# Altium schematic sheet Time4CM4_SIT_module.SchDoc
size A4; SheetNumber: 1; SheetTotal: 1
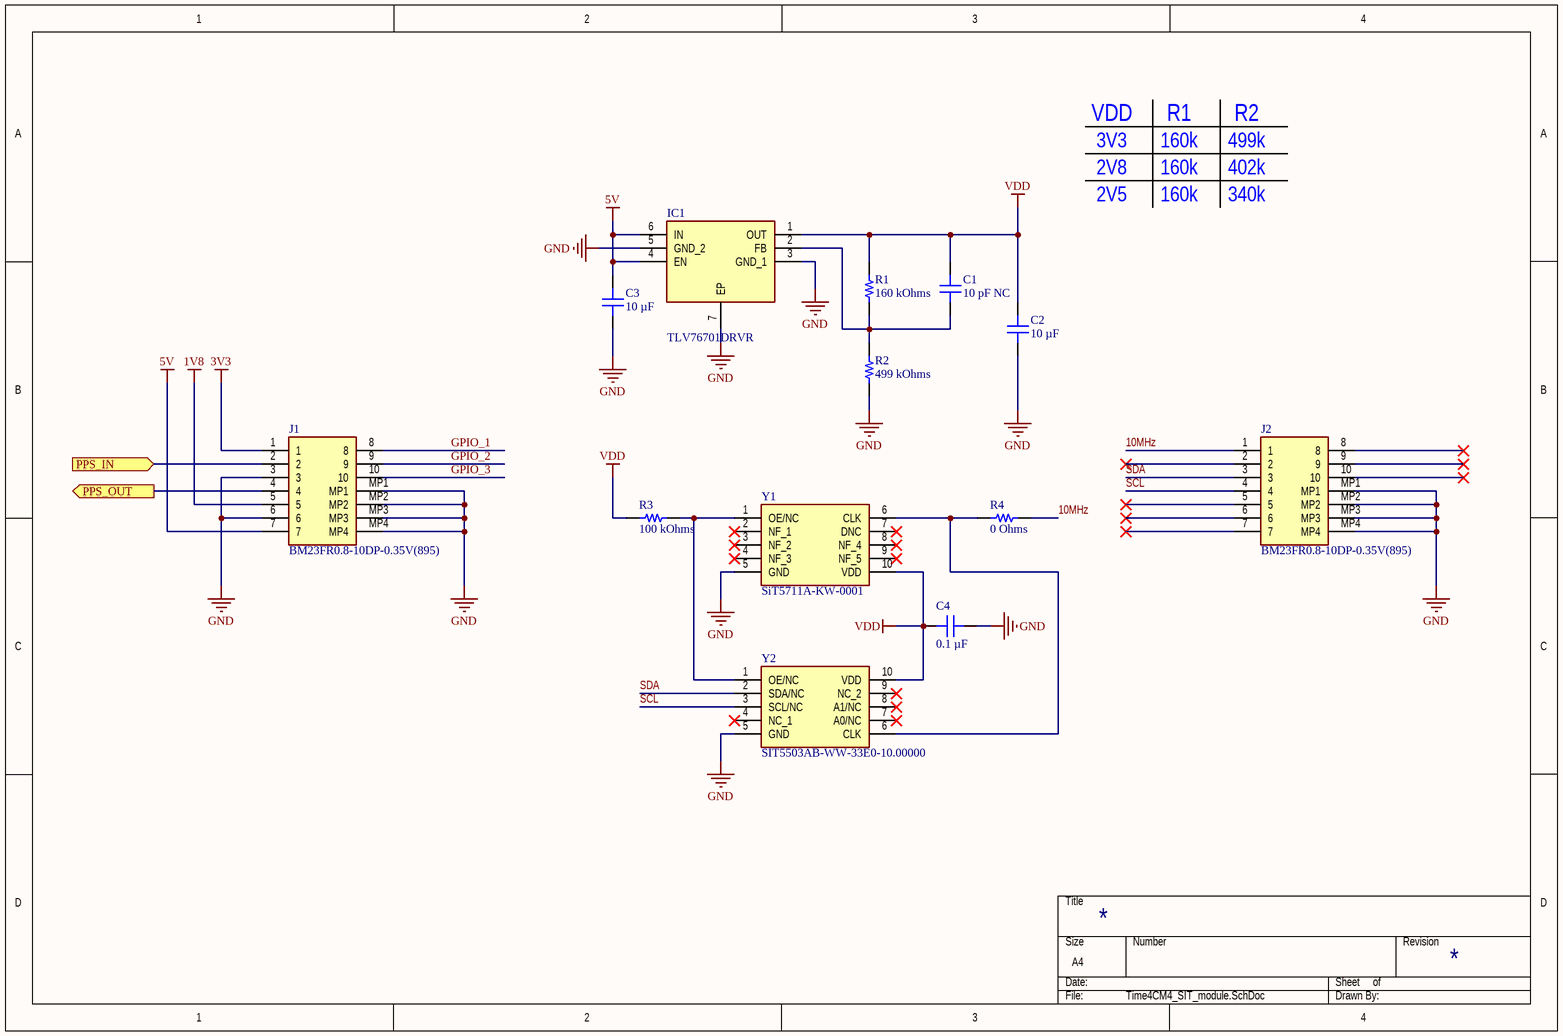
[diagram p0: Time4CM4_SIT_module.SchDoc]

## Parts
C1  10 pF NC  [CAP 0402_1005]
C2  10 µF  [CAP 0603_1608]
C3  10 µF  [CAP 0603_1608]
C4  0.1 µF  [CAP 0402_1005]
IC1  TLV76701DRVR  [SON65P200X200X80-7N]
J1  BM23FR0.8-10DP-0.35V(895)  [BM23FR0810DP035V895]
J2  BM23FR0.8-10DP-0.35V(895)  [BM23FR0810DP035V895]
R1  160 kOhms  [YAGEO RES 0402_1005]
R2  499 kOhms  [YAGEO RES 0402_1005]
R3  100 kOhms  [YAGEO RES 0402_1005]
R4  0 Ohms  [YAGEO RES 0402_1005]
Y1  SiT5711A-KW-0001  [Emerald_9070_10pins_2022]
Y2  SIT5503AB-WW-33E0-10.00000  [Ceramic_QFN_7050_10pins]

## Ports
PPS_IN (in), PPS_OUT (out)

## Nets
1V8: J1.5
3V3: J1.1
5V: C3.2 IC1.4(EN) IC1.6(IN) J1.7
GND: C2.1 C3.1 C4.1 IC1.3(GND_1) IC1.5(GND_2) IC1.7(EP) J1.3 J1.6 J1.MP1 J1.MP2 J1.MP3 J1.MP4 J2.MP1 J2.MP2 J2.MP3 J2.MP4 R2.1 Y1.5(GND) Y2.5(GND)
VDD: C1.2 C2.2 C4.2 IC1.1(OUT) R1.2 R3.1 Y1.10(VDD) Y2.10(VDD)
10MHz: J2.1 R4.1
GPIO_1: J1.8
GPIO_2: J1.9
GPIO_3: J1.10
PPS_IN: J1.2 ; port PPS_IN
PPS_OUT: J1.4 ; port PPS_OUT
SCL: J2.4 Y2.3(SCL/NC)
SDA: J2.3 Y2.2(SDA/NC)
NetC1_1: C1.1 IC1.2(FB) R1.1 R2.2
NetR3_2: R3.2 Y1.1(OE/NC) Y2.1(OE/NC)
NetR4_2: R4.2 Y1.6(CLK) Y2.6(CLK)

Not connected (* = marked no-connect by the designer): J2 2* 5* 6* 7* 8* 9* 10*; Y1 2(NF_1)* 3(NF_2)* 4(NF_3)* 7(DNC)* 8(NF_4)* 9(NF_5)*; Y2 4(NC_1)* 7(A0/NC)* 8(A1/NC)* 9(NC_2)*

## Notes on the sheet
- VDD
- R1
- R2
- 2V8
- 3V3
- 160k
- 499k
- 402k
- 2V5
- 340k
- DWG. NO.
- REV.
- SHT.
- REVISION
- DESCRIPTION
- DATE
- APPROVED
- THIS DOCUMENT AND THE DATA DISCLOSED HEREIN OR HEREWITH IS THE PROPERTY OF ALTIUM LIMITED AND MAY BE FREELY DISTRIBUTED IN WHOLE. NO RIGHTS ARE RESERVED OR EXPRESS OR IMPLIED WARANTEE GIVEN.
- ENG:
- DSN:
- APPROVALS
- PROJECT
- DOCUMENT REVISION:
- DESIGN ITEM:
- CHK:
- BOM:
- REFERENCE DOCUMENTS
- PROJECT REVISION:
- TITLE
- FAB DWG:
- PCB DWG:
- ASSY DWG:
- SCALE:
- SIZE
- C
- CAGE CODE
- FILE NAME
- DWG NO.
- SHEET
- OF
- REV

## Library data of the parts
C1 = CC0402KRNPO9BN100: CAP CER 10PF 50V C0G/NPO 0402; manufacturer: Yageo; Temperature Coefficient: C0G, NP0; Tolerance: ±10%; Part Number: CC0402KRNPO9BN100; Value: 10 pF NC; Applications: General Purpose; Capacitance: 10 pF; componentlink1description: Datasheet; componentlink1url: https://www.yageo.com/upload/media/product/productsearch/datasheet/mlcc/UPY-GP_NP0_16V-to-50V_18.pdf; componentlink2description: DigiKey Link; componentlink2url: https://www.digikey.com/en/products/detail/yageo/CC0402KRNPO9BN100/11489535; Device Package: 0402 (1005 Metric); lastupdated: 09.02.2024 20:03:43; Lifecycle Status: Active; Minimum Order: 10; Mounting Type: Surface Mount, MLCC; Operating Temperature: -55°C ~ 125°C; Package / Case: 0402 (1005 Metric); packaging: CutTape; partid: 52087; Part Status: Active; price: 0.01; series: CC; Size / Dimension: 0.039" L x 0.020" W (1.00mm x 0.50mm); Supplier 1: DigiKey; Supplier Part Number 1: 13-CC0402KRNPO9BN100CT-ND; Thickness (Max): 0.022" (0.55mm); Voltage - Rated: 50V
C2 C3 = CC0603MPX5R5BB106: CAP CER 10UF 6.3V X5R 0603; manufacturer: Yageo; Tolerance: ±20%; Part Number: CC0603MPX5R5BB106; Value: 10 µF; Applications: General Purpose; Capacitance: 10 µF; componentlink1description: Datasheet; componentlink1url: https://www.yageo.com/upload/media/product/productsearch/datasheet/mlcc/UPY-GPHC_X5R_4V-to-50V_26.pdf; componentlink2description: DigiKey Link; componentlink2url: https://www.digikey.com/en/products/detail/yageo/CC0603MPX5R5BB106/13899929; Device Package: 0603 (1608 Metric); lastupdated: 09.02.2024 20:09:51; Lifecycle Status: Active; Minimum Order: 10; Mounting Type: Surface Mount, MLCC; Operating Temperature: -55°C ~ 85°C; Package / Case: 0603 (1608 Metric); packaging: TapeAndReel; partid: 42060; Part Status: Active; price: 0.03; series: CC; Size / Dimension: 0.063" L x 0.031" W (1.60mm x 0.80mm); Supplier 1: DigiKey; Supplier Part Number 1: 13-CC0603MPX5R5BB106CT-ND; Temperature Coefficient: X5R; Thickness (Max): 0.037" (0.95mm); Voltage - Rated: 6.3V
C4 = CC0402KRX7R5BB104: CAP CER 0.1UF 6.3V X7R 0402; manufacturer: Yageo; Tolerance: ±10%; Part Number: CC0402KRX7R5BB104; Value: 0.1 µF; Applications: General Purpose; Capacitance: 0.1 µF; componentlink1description: Datasheet; componentlink1url: https://www.yageo.com/upload/media/product/productsearch/datasheet/mlcc/UPY-GPHC_X7R_6.3V-to-50V_18.pdf; componentlink2description: DigiKey Link; componentlink2url: https://www.digikey.com/en/products/detail/yageo/CC0402KRX7R5BB104/5195110; Device Package: 0402 (1005 Metric); lastupdated: 09.02.2024 20:04:20; Lifecycle Status: Active; Minimum Order: 10; Mounting Type: Surface Mount, MLCC; Operating Temperature: -55°C ~ 125°C; Package / Case: 0402 (1005 Metric); packaging: TapeAndReel; partid: 12548; Part Status: Active; price: 0.01; series: CC; Size / Dimension: 0.039" L x 0.020" W (1.00mm x 0.50mm); Supplier 1: DigiKey; Supplier Part Number 1: 311-1701-1-ND; Temperature Coefficient: X7R; Thickness (Max): 0.022" (0.55mm); Voltage - Rated: 6.3V
IC1 = TLV76701DRVR: IC REG LINEAR POS ADJ 1A 6WSON; Manufacturer_Name: Texas Instruments; Datasheet Link: http://www.ti.com/lit/gpn/TLV767; Height: 0.8mm; Manufacturer_Part_Number: TLV76701DRVR; Mouser Part Number: 595-TLV76701DRVR; Mouser Price/Stock: https://www.mouser.co.uk/ProductDetail/Texas-Instruments/TLV76701DRVR?qs=l7cgNqFNU1h4nW14BHdGSQ%3D%3D; Arrow Part Number: TLV76701DRVR; Arrow Price/Stock: https://www.arrow.com/en/products/tlv76701drvr/texas-instruments?region=nac
J1 J2 = BM23FR0.8-10DS-0.35V_895_: Connector; Manufacturer_Name: Hirose; Manufacturer_Part_Number: BM23FR0.8-10DS-0.35V(895); Datasheet Link: https://componentsearchengine.com/Datasheets/1/BM23FR0.8-10DS-0.35V(895).pdf; Height: 0.9mm; Mouser Part Number: 798-3FR0810DS035V895; Mouser Price/Stock: https://www.mouser.co.uk/ProductDetail/Hirose-Connector/BM23FR08-10DS-035V895/?qs=YCa%2FAAYMW01IXWgIGURT8A%3D%3D
R1 = RC0402FR-07160KL: RES 160K OHM 1% 1/16W 0402; Manufacturer: Yageo; Power (Watts): 0.063W, 1/16W; Temperature Coefficient: ±100ppm/°C; Part Number: RC0402FR-07160KL; Value: 160 kOhms; ComponentLink1Description: Datasheet; ComponentLink1URL: https://www.yageo.com/upload/media/product/productsearch/datasheet/rchip/PYu-RC_Group_51_RoHS_L_10.pdf; ComponentLink2Description: DigiKey Link; ComponentLink2URL: https://www.digikey.com/en/products/detail/yageo/RC0402FR-07160KL/5280856; Composition: Thick Film; Device Package: 0402 (1005 Metric); Features: Moisture Resistant; Height - Seated (Max): 0.016" (0.40mm); LastUpdated: 25.07.2024 9:18:19; Lifecycle Status: Active; Minimum Order: 1; Number of Terminations: 2; Operating Temperature: -55°C ~ 155°C; Package / Case: 0402 (1005 Metric); Packaging: CutTape; PartId: 2582; Part Status: Active; Price: 0.01; Resistance: 160 kOhms; Series: RC_L; Size / Dimension: 0.039" L x 0.020" W (1.00mm x 0.50mm); Supplier 1: DigiKey; Supplier Part Number 1: YAG2996CT-ND; Supplier Device Package: 0402; Tolerance: ±1%
R2 = RC0402FR-07499KL: RES 499K OHM 1% 1/16W 0402; Manufacturer: Yageo; Power (Watts): 0.063W, 1/16W; Temperature Coefficient: ±100ppm/°C; Part Number: RC0402FR-07499KL; Value: 499 kOhms; ComponentLink1Description: Datasheet; ComponentLink1URL: https://www.yageo.com/upload/media/product/productsearch/datasheet/rchip/PYu-RC_Group_51_RoHS_L_10.pdf; ComponentLink2Description: DigiKey Link; ComponentLink2URL: https://www.digikey.com/en/products/detail/yageo/RC0402FR-07499KL/726622; Composition: Thick Film; Device Package: 0402 (1005 Metric); Features: Moisture Resistant; Height - Seated (Max): 0.016" (0.40mm); LastUpdated: 25.07.2024 9:18:19; Lifecycle Status: Active; Minimum Order: 1; Number of Terminations: 2; Operating Temperature: -55°C ~ 155°C; Package / Case: 0402 (1005 Metric); Packaging: CutTape; PartId: 2647; Part Status: Active; Price: 0.01; Resistance: 499 kOhms; Series: RC_L; Size / Dimension: 0.039" L x 0.020" W (1.00mm x 0.50mm); Supplier 1: DigiKey; Supplier Part Number 1: 311-499KLRCT-ND; Supplier Device Package: 0402; Tolerance: ±1%
R3 = RC0402FR-07100KL: RES 100K OHM 1% 1/16W 0402; Manufacturer: Yageo; Power (Watts): 0.063W, 1/16W; Temperature Coefficient: ±100ppm/°C; Part Number: RC0402FR-07100KL; Value: 100 kOhms; ComponentLink1Description: Datasheet; ComponentLink1URL: https://www.yageo.com/upload/media/product/productsearch/datasheet/rchip/PYu-RC_Group_51_RoHS_L_10.pdf; ComponentLink2Description: DigiKey Link; ComponentLink2URL: https://www.digikey.com/en/products/detail/yageo/RC0402FR-07100KL/726526; Composition: Thick Film; Device Package: 0402 (1005 Metric); Features: Moisture Resistant; Height - Seated (Max): 0.016" (0.40mm); LastUpdated: 25.07.2024 9:18:11; Lifecycle Status: Active; Minimum Order: 1; Number of Terminations: 2; Operating Temperature: -55°C ~ 155°C; Package / Case: 0402 (1005 Metric); Packaging: CutTape; PartId: 17595; Part Status: Active; Price: 0.01; Resistance: 100 kOhms; Series: RC_L; Size / Dimension: 0.039" L x 0.020" W (1.00mm x 0.50mm); Supplier 1: DigiKey; Supplier Part Number 1: 311-100KLRCT-ND; Supplier Device Package: 0402; Tolerance: ±1%
R4 = RC0402FR-070RL: RES 0 OHM JUMPER 1/16W 0402; Manufacturer: Yageo; Power (Watts): 0.063W, 1/16W; Part Number: RC0402FR-070RL; Value: 0 Ohms; ComponentLink1Description: Datasheet; ComponentLink1URL: https://www.yageo.com/upload/media/product/productsearch/datasheet/rchip/PYu-RC_Group_51_RoHS_L_10.pdf; ComponentLink2Description: DigiKey Link; ComponentLink2URL: https://www.digikey.com/en/products/detail/yageo/RC0402FR-070RL/2827570; Composition: Thick Film; Device Package: 0402 (1005 Metric); Features: Moisture Resistant; Height - Seated (Max): 0.016" (0.40mm); LastUpdated: 25.07.2024 9:18:11; Lifecycle Status: Active; Minimum Order: 1; Number of Terminations: 2; Operating Temperature: -55°C ~ 155°C; Package / Case: 0402 (1005 Metric); Packaging: CutTape; PartId: 17630; Part Status: Active; Price: 0.01; Resistance: 0 Ohms; Series: RC_L; Size / Dimension: 0.039" L x 0.020" W (1.00mm x 0.50mm); Supplier 1: DigiKey; Supplier Part Number 1: 311-0.0LRCT-ND; Supplier Device Package: 0402; Tolerance: Jumper
Y1 = SiT5711A-KW-0001: Crystal or Oscillator; Manufacturer_Name: SiTime; Datasheet Link: https://www.sitime.com/support/resource-library/datasheets/sit5711-datasheet; Height: 6.19mm; Manufacturer_Part_Number: SiT5711A-KW-0001
Y2 = SIT5503AB-WW-33E0-10.00000: Crystal or Oscillator; Manufacturer_Name: SiTime; Height: 2.2mm; Manufacturer_Part_Number: SIT5503AB-WW-33E0-10.00000